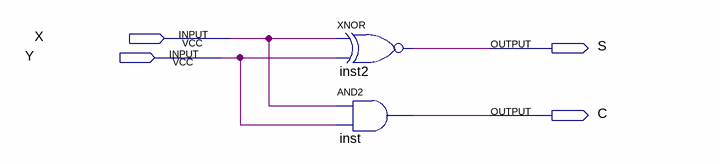
[diagram p0: schematic sheet]
// Quartus schematic halfAdder.bdf as structural Verilog: 2 symbols, 4 pins
module halfAdder (
  input  X,
  input  Y,
  output S,
  output C
);

  xnor inst2 (S, X, Y);
  and inst (C, X, Y);
endmodule
